# EAGLE design single DPswap (EAGLE 6.1)
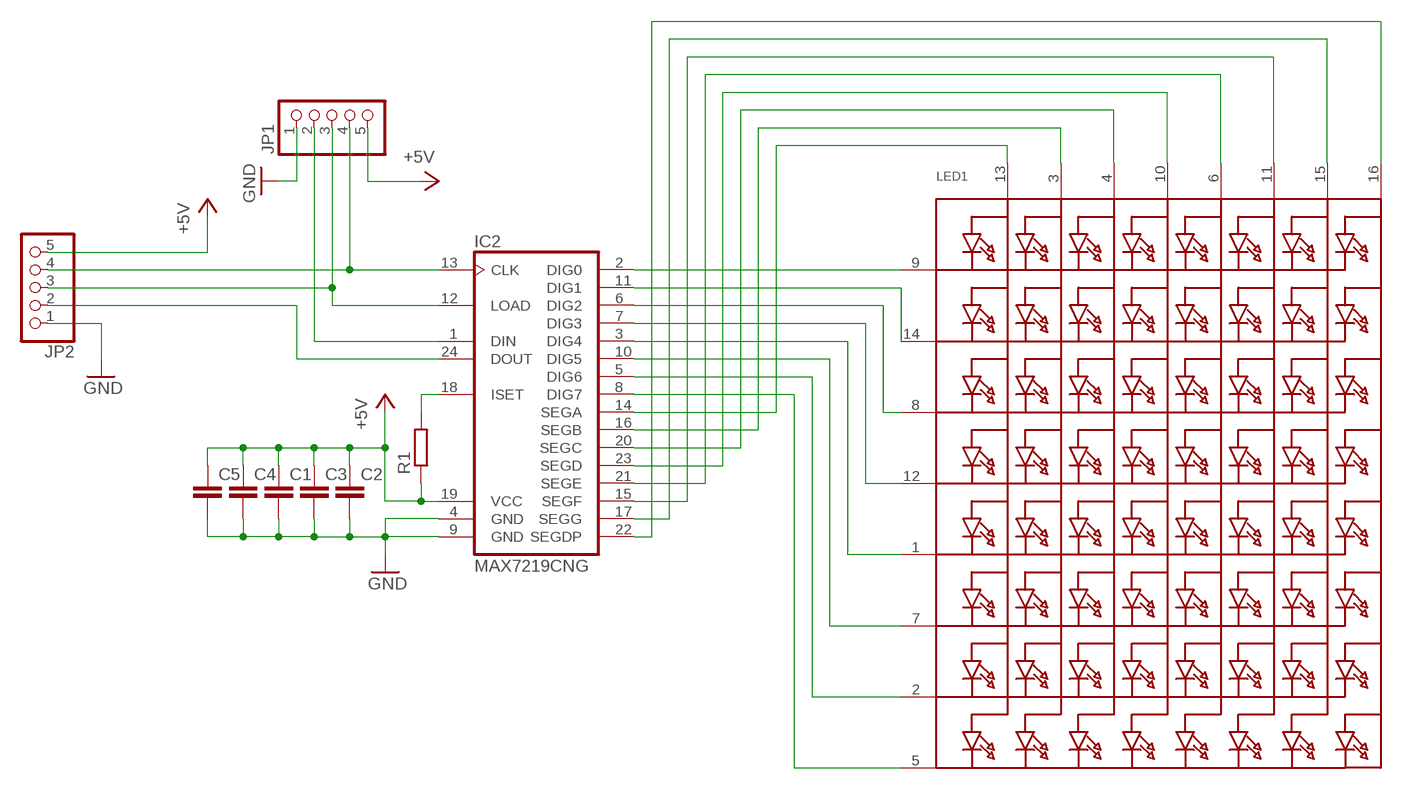
[diagram p0: schematic, sheet 1]

## Parts
C1  C-EUC0805K  [C0805K]
C2  C-EUC0805K  [C0805K]
C3  C-EUC0805K  [C0805K]
C4  C-EUC0805K  [C0805K]
C5  C-EUC0805K  [C0805K]
IC2  MAX7219CNG  [DIL24-3]
JP1  PINHD-1X5/90  [1X05/90]
JP2  PINHD-1X5/90  [1X05/90]
LED1  SEGMENT_8X8_ROWCATHODEM12A881UR  [SEGMENT_BL-M12A881UR]
R1  R-EU_M0805  [M0805]

## Nets
+5V: C1.1 C2.1 C3.1 C4.1 C5.1 IC2.19(VCC) JP1.5 JP2.5 R1.1
GND: C1.2 C2.2 C3.2 C4.2 C5.2 IC2.4(GND) IC2.9(GND) JP1.1 JP2.1
N$17: IC2.2(DIG0) LED1.9(K1)
N$18: IC2.11(DIG1) LED1.14(K2)
N$19: IC2.6(DIG2) LED1.8(K3)
N$20: IC2.7(DIG3) LED1.12(K4)
N$21: IC2.3(DIG4) LED1.1(K5)
N$22: IC2.10(DIG5) LED1.7(K6)
N$23: IC2.5(DIG6) LED1.2(K7)
N$24: IC2.8(DIG7) LED1.5(K8)
N$25: IC2.14(SEGA) LED1.13(A1)
N$26: IC2.16(SEGB) LED1.3(A2)
N$27: IC2.20(SEGC) LED1.4(A3)
N$28: IC2.23(SEGD) LED1.10(A4)
N$29: IC2.21(SEGE) LED1.6(A5)
N$30: IC2.15(SEGF) LED1.11(A6)
N$31: IC2.17(SEGG) LED1.15(A7)
N$32: IC2.22(SEGDP) LED1.16(A8)
N$33: IC2.24(DOUT) JP2.2
N$36: IC2.13(CLK) JP1.4 JP2.4
N$37: IC2.12(LOAD) JP1.3 JP2.3
N$40: IC2.18(ISET) R1.2
N$42: IC2.1(DIN) JP1.2

## Library data of the parts
C1-C5 = rcl:C-EU: CAPACITOR, European symbol
IC2 = maxim:MAX7219CNG: LED DISPLAY DRIVER; MF: MAXIM; MPN: MAX7219CNG; OC_FARNELL: 1523914; OC_NEWARK: 34C4018
JP1 JP2 = pinhead:PINHD-1X5: PIN HEADER
LED1 = adafruit:SEGMENT_8X8_ROWCATHODE: 8x8 LED Segment Displays: Row = Cathode 0.7" Red 8X8 Matrix, 1.9mm Round LEDs - BL-M07C881UR 1.2" Red 8x8 Matrix, 3.0mm Round LEDs - BL-M12A881UR 1.2" Red 8x8 Matrix, 3.0mm Square LEDs - BL-M12A883
R1 = rcl:R-EU_: RESISTOR, European symbol

## Board
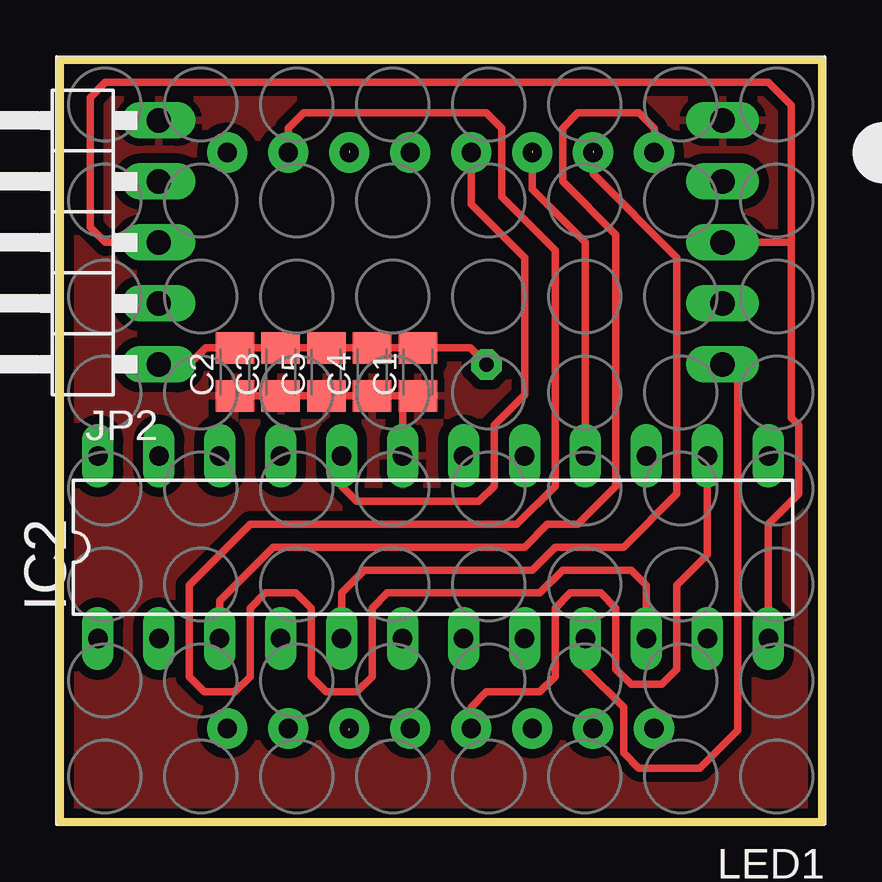
[diagram p1: board, top side]
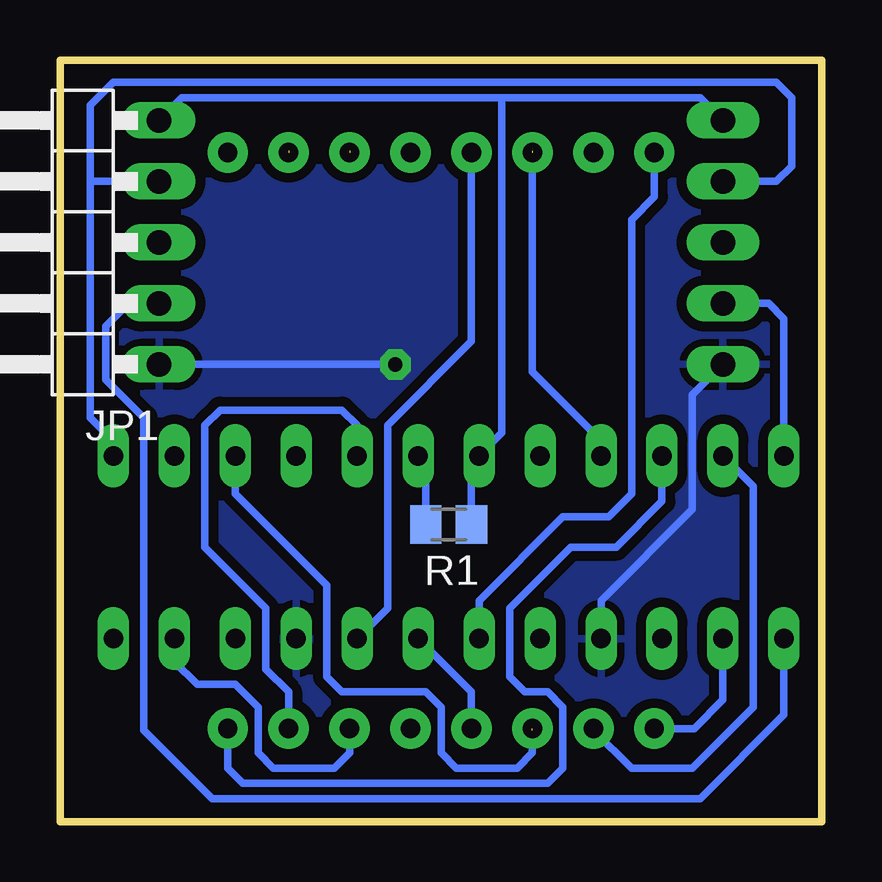
[diagram p2: board, bottom side, seen from below]

Size 31.74 x 31.73 mm. Coordinates in mm from the lower left corner, seen from the top.
Outline: 31.74,0 31.74,31.73 0,31.73 0,0 31.74,0
Copper layers (1*16): Top 0.035mm / dielectric 1.5mm / Bottom 0.035mm
Design rules: minimum track width 10mil, minimum drill 24mil, track to track 12mil, track to pad 12mil, pad to pad 12mil, via to via 12mil, smd to smd 10mil, copper to edge 12mil, drill to drill 12mil, minimum pad ring 10mil, minimum via ring 10mil, stop-mask expansion 4mil, vias tented up to drill 0mil, thermal gap 12mil

### Footprints (pad centres in the part's own frame; a part is rotated, then mirrored left to right if it is on the bottom)
C0805K = smd 1.3 x 1.6: 1 -1,0; 2 1,0
DIL24-3 = drill 0.813 long: 1 -13.97,-3.81; 2 -11.43,-3.81; 3 -8.89,-3.81; 4 -6.35,-3.81; 5 -3.81,-3.81; 6 -1.27,-3.81; 7 1.27,-3.81; 8 3.81,-3.81; 9 6.35,-3.81; 10 8.89,-3.81; 11 11.43,-3.81; 12 13.97,-3.81; 13 13.97,3.81; 14 11.43,3.81; 15 8.89,3.81; 16 6.35,3.81; 17 3.81,3.81; 18 1.27,3.81; 19 -1.27,3.81; 20 -3.81,3.81; 21 -6.35,3.81; 22 -8.89,3.81; 23 -11.43,3.81; 24 -13.97,3.81
1X05/90 = drill 1.016 long: 1 -5.08,-3.81; 2 -2.54,-3.81; 3 0,-3.81; 4 2.54,-3.81; 5 5.08,-3.81
SEGMENT_BL-M12A881UR = drill 0.8 pad 1.676: 1 -8.89,-12; 2 -6.35,-12; 3 -3.81,-12; 4 -1.27,-12; 5 1.27,-12; 6 3.81,-12; 7 6.35,-12; 8 8.89,-12; 9 8.89,12; 10 6.35,12; 11 3.81,12; 12 1.27,12; 13 -1.27,12; 14 -3.81,12; 15 -6.35,12; 16 -8.89,12
M0805 = smd 1.3 x 1.6: 1 -0.95,0; 2 0.95,0

### Placement (x,y rotation side)
C1  14.91,18.73 90 top
C2  7.29,18.73 90 top
C3  9.19,18.73 90 top
C4  13.01,18.73 90 top
C5  11.1,18.73 90 top
IC2  15.54,11.43 0 top
JP1  31.42,24.13 90 bottom
JP2  0.3,24.13 90 top
LED1  15.86,15.88 180 top
R1  15.54,12.38 180 bottom

### Tracks (layer width: path | path; a pad name or v marks a point on that pad's centre or on a via)
+5V
  Top 0.305: IC2.19 14.28,17.73 | C2.1 C3.1 C5.1 C4.1 14.28,17.73 | 14.28,17.73 C1.1 | 14.28,17.78 14.28,17.73
  Bottom 0.305: R1.1 14.6,14.92 IC2.19 13.32,16.19 13.32,30.16 | JP1.5 26.66,30.16 13.32,30.16 | JP2.5 5.07,30.16 13.32,30.16
  pour Top (isolate 0.406): -0.01,31.75 31.74,31.75 31.74,-2.22 -0.01,-2.22
GND  (via drill 0.6 pad 1.27)
  Top 0.305: IC2.9 21.89,6.35 23.48,4.76 23.48,2.86 24.12,2.22 26.66,2.22 28.24,3.81 28.24,18.41 JP1.1 | JP2.1 5.38,19.05 6.07,19.73 C2.2 C3.2 C5.2 C4.2 C1.2 17.09,19.73 v17.77,19.05
  Bottom 0.305: IC2.4 9.19,9.21 5.38,13.02 5.38,17.78 JP2.1 | JP1.1 v17.77,19.05
  pour Bottom (isolate 0.406): -0.01,-3.81 -0.01,31.75 31.74,31.75 31.74,-3.81
N$17
  Bottom 0.305: LED1.9 5.32,3.88 4.12,5.08 IC2.2
N$18
  Bottom 0.305: LED1.14 19.67,2.86 20.31,2.22 22.85,2.22 23.48,2.86 23.48,4.76 24.43,5.71 26.02,5.71 26.97,6.67 IC2.11
N$19
  Bottom 0.305: 6.97,27.94 LED1.8 6.97,26.04 7.92,25.08 7.92,13.65 8.88,12.7 10.78,12.7 14.28,9.21 IC2.6
N$20
  Bottom 0.305: LED1.12 14.59,5.4 IC2.7
N$21
  Top 0.305: LED1.1 24.75,28.89 24.12,29.53 21.58,29.53 20.94,28.89 20.94,26.67 23.16,24.45 23.16,13.97 21.58,12.38 20.31,12.38 19.35,11.43 8.88,11.43 6.65,9.21 IC2.3
N$22
  Top 0.305: LED1.7 9.51,28.89 10.15,29.53 17.77,29.53 18.4,28.89 18.4,26.04 20.62,23.81 20.62,13.97 19.04,12.38 7.92,12.38 5.38,9.84 5.38,6.03 6.02,5.4 7.29,5.4 7.92,6.03 7.92,8.89 8.56,9.53 9.83,9.53 10.46,8.89 10.46,6.03 11.1,5.4 12.37,5.4 13.01,6.03 13.01,8.89 13.64,9.53 19.99,9.53 20.94,10.48 23.8,10.48 24.43,9.84 IC2.10
N$23  (1 unrouted)
  Top 0.305: IC2.5 11.74,9.53 12.69,10.48 19.67,10.48 20.62,11.43 23.48,11.43 25.7,13.65 25.7,23.5 22.21,26.99 22.21,27.94
N$24
  Bottom 0.305: IC2.8 18.09,8.89 18.09,16.51 14.59,20 LED1.5
N$25
  Top 0.305: LED1.13 17.13,4.76 17.77,5.4 19.99,5.4 20.62,6.03 20.62,8.89 21.26,9.53 22.53,9.53 23.16,8.89 23.16,6.35 23.8,5.71 25.07,5.71 25.7,6.35 25.7,9.84 26.97,11.11 IC2.14
N$26  (1 unrouted)
  Top 0.305: IC2.16 21.89,24.13 19.67,26.35 19.67,27.94
N$27
  Top 0.305: IC2.20 11.74,13.97 12.37,13.34 17.45,13.34 18.09,13.97 18.09,16.51 19.35,17.78 19.35,23.5 17.13,25.72 LED1.4
N$28
  Bottom 0.305: LED1.10 9.51,3.81 7.92,2.22 5.38,2.22 2.85,4.76 2.85,13.97 IC2.23
N$29  (1 unrouted)
  Bottom 0.305: IC2.21 9.19,15.88 12.05,18.73 12.05,27.94
N$30  (1 unrouted)
  Bottom 0.305: IC2.15 24.43,13.65 20.62,9.84 20.62,6.03 19.99,5.4 16.5,5.4 15.86,4.76 15.86,2.86 15.23,2.22 12.69,2.22 12.05,2.86 12.05,3.81
N$31
  Bottom 0.305: LED1.15 22.21,5.4 23.16,6.35 23.16,8.89 25.7,11.43 25.7,16.51 25.07,17.14 19.99,17.14 19.35,16.51 IC2.17
N$32
  Bottom 0.305: LED1.16 24.75,2.22 24.12,1.59 11.42,1.59 10.78,2.22 10.78,4.76 11.42,5.4 12.37,5.4 13.01,6.03 13.01,8.89 10.46,11.43 8.56,11.43 6.65,13.34 IC2.22
N$33
  Bottom 0.305: IC2.24 1.58,20.95 2.21,21.59 JP2.2
N$36
  Bottom 0.305: 30.47,26.67 30.47,29.84 29.52,30.8 1.89,30.8 1.26,30.16 1.26,27.3 1.89,26.67 JP2.4 | JP1.4 30.47,26.67 | IC2.13 29.52,15.88 30.47,16.83 30.47,26.67
N$37
  Top 0.305: 30.47,24.13 30.47,29.84 29.52,30.8 1.89,30.8 1.26,30.16 1.26,24.77 1.89,24.13 JP2.3 | IC2.12 29.52,12.38 30.78,13.65 30.78,16.51 30.47,16.83 30.47,24.13 | JP1.3 30.47,24.13
N$40
  Bottom 0.305: R1.2 16.49,14.92 IC2.18
N$42
  Bottom 0.305: IC2.1 1.58,4.45 5.07,0.95 25.39,0.95 28.24,3.81 28.24,16.83 29.83,18.41 29.83,20.64 28.88,21.59 JP1.2